# Altium schematic sheet CAN.SchDoc: CAN
size A4; DocumentNumber: 2; SheetNumber: 2; SheetTotal: 6
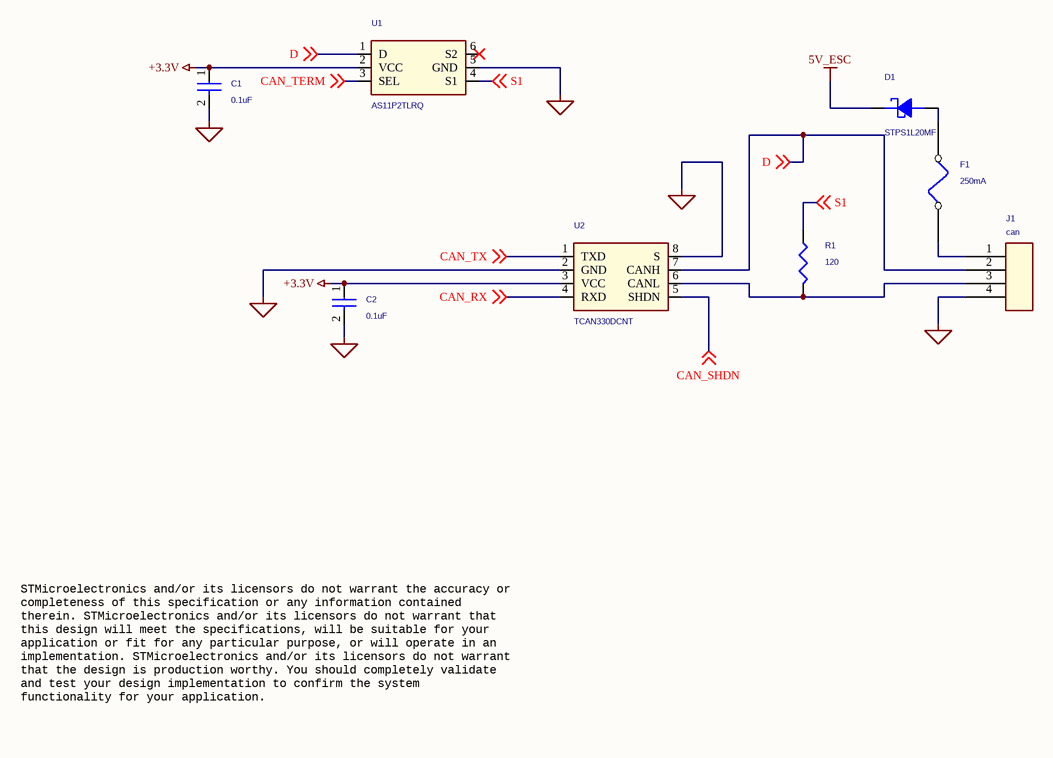
[diagram p0: CAN.SchDoc]

## Parts
C1  0.1uF  [C_0402]
C2  0.1uF  [C_0402]
D1  STPS1L20MF  [do216-aa-flat]
F1  250mA  [f_0402]
J1  can  [SOLDER_PAD_4PIN_SMD]
R1  120  [R_0402]
U1  AS11P2TLRQ  [son6p40_120x100x55l35x20]
U2  TCAN330DCNT  [sot23-8p65_280x145l45x30n]

## Nets
5V_ESC: D1.C
+3.3V: C1.1 C2.1 U1.2(VCC) U2.3(VCC)
GND_SIGNAL: C1.2 C2.2 J1.4 U1.5(GND) U2.2(GND) U2.8(S)
CAN_RX: U2.4(RXD) ; off-sheet CAN_RX
CAN_SHDN: U2.5(SHDN) ; off-sheet CAN_SHDN
CAN_TERM: U1.3(SEL) ; off-sheet CAN_TERM
CAN_TX: U2.1(TXD) ; off-sheet CAN_TX
D: J1.2 U1.1(D) U2.7(CANH) ; off-sheet D
S1: R1.1 U1.4(S1) ; off-sheet S1
NetD1_A: D1.A F1.2
NetF1_1: F1.1 J1.1
NetJ1_3: J1.3 R1.2 U2.6(CANL)

Not connected (* = marked no-connect by the designer): U1 6(S2)*

## Notes on the sheet
- STMicroelectronics and/or its licensors do not warrant the accuracy or
  completeness of this specification or any information contained
  therein. STMicroelectronics and/or its licensors do not warrant that
  this design will meet the specifications, will be suitable for your
  application or fit for any particular purpose, or will operate in an
  implementation. STMicroelectronics and/or its licensors do not warrant
  that the design is production worthy. You should completely validate
  and test your design implementation to confirm the system
  functionality for your application.
- Title:
- Project:
- Size:
- Revision:
- Variant:
- A4
- -
- Date:
- Reference:
- Sheet:
- of

## Library data of the parts
C1 C2 = CAP_Dup1: CAP CER 0.1UF 16V X7R 0402; PART_NUMBER: CAP-00000053; Manufacturer: Wurth Electronics Inc.; Manufacturer PN: 885012205037; Dielectric Type: Capacitors; Tolerance: 10%; CLASS: DISCRETE; Package Size: 0402 (1005 Metric); Temperature Coefficient: X7R; Rated Voltage: 16V
D1 = DIODE_SCHOTTKY_0: DIODE SCHOTTKY 20V 1A STMITEFLAT; Manufacturer: STMicroelectronics; PART_NUMBER: TMP-380; CLASS: DISCRETE; Rated Voltage: 430mV @ 1A; Manufacturer PN: STPS1L20MF; Package Size: DO-222AA
F1 = FUSE: FUSE BOARD MNT 250MA 32VDC 0402; Manufacturer Code: 0435.250KRS; Manufacturer: Littelfuse Inc.; PART_NUMBER: TMP-439; RS/Distrelec/Other Code: MOUSER: 576-0435.250KRS; CLASS: DISCRETE; Package Size: 0.039" L x 0.020" W x 0.013" H (0.99mm x 0.51mm x 0.33mm); Manufacturer PN: 0435.250KRS
J1 = CON4: SOLDER PADS
R1 = RES: RES SMD 120 OHM 1% 1/16W 0402; PART_NUMBER: TMP-441; Manufacturer: Yageo; Manufacturer PN: RC0402FR-07120RL; Temperature Coefficient: 100ppm/C; Rated Power: 0.063W, 1/16W; CLASS: DISCRETE; Package Size: 0402 (1005 Metric); Tolerance: 1%
U1 = AS11P2TLR: IC ANLG SWITCH SGL SPDT 6QFN; Manufacturer: STMicroelectronics; PART_NUMBER: TMP-378; Manufacturer PN: AS11P2TLRQ; CLASS: IC; Package Size: 6-UFDFN
U2 = TCAN330: IC TXRX CAN 3.3V SOT-23; PART_NUMBER: TMP-379; Manufacturer: Texas Instruments; Supply Voltage: 3 V ~ 3.6 V; Package Size: SOT-23-8; CLASS: IC; Manufacturer PN: TCAN330DCNT